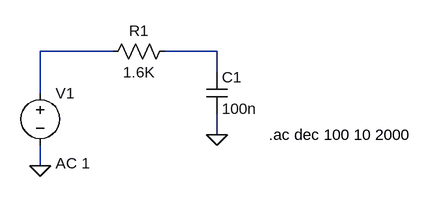
[diagram p0: schematic low_pass_filter.asc]
low_pass_filter.asc, the LTspice schematic file:
Version 4.1
SHEET 1 880 680
WIRE 128 64 16 64
WIRE 288 64 208 64
WIRE 288 96 288 64
WIRE 16 128 16 64
WIRE 288 192 288 160
WIRE 16 240 16 208
FLAG 16 240 0
FLAG 288 192 0
SYMBOL res 224 48 R90
WINDOW 0 0 56 VBottom 2
WINDOW 3 32 56 VTop 2
SYMATTR InstName R1
SYMATTR Value 1.6K
SYMBOL cap 272 96 R0
SYMATTR InstName C1
SYMATTR Value 100n
SYMBOL voltage 16 112 R0
WINDOW 123 24 124 Left 2
WINDOW 39 0 0 Left 0
SYMATTR Value2 AC 1
SYMATTR InstName V1
SYMATTR Value ""
TEXT 368 192 Left 2 !.ac dec 100 10 2000

The netlist it stands for:
* low_pass_filter.asc
R1 N002 N001 1.6K
C1 N002 0 100n
V1 N001 0 AC 1
.ac dec 100 10 2000
.backanno
.end